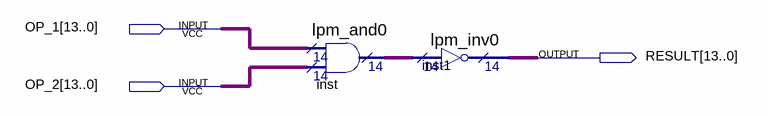
[diagram p0: schematic sheet]
// Quartus schematic OP_NAND.bdf as structural Verilog: 2 symbols, 3 pins
module OP_NAND (
  input  [13:0] OP_1,
  input  [13:0] OP_2,
  output [13:0] RESULT
);

  wire [13:0] inst_result;

  lpm_and0 inst (.data0x(OP_1), .data1x(OP_2), .result(inst_result));
  lpm_inv0 inst1 (.data(inst_result), .result(RESULT));
endmodule
